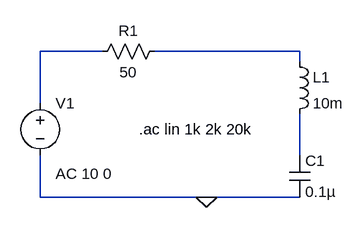
[diagram p0: schematic Draft3.asc]
Draft3.asc, the LTspice schematic file:
Version 4
SHEET 1 880 680
WIRE 112 48 16 48
WIRE 416 48 192 48
WIRE 416 64 416 48
WIRE 16 128 16 48
WIRE 416 208 416 144
WIRE 16 272 16 208
WIRE 272 272 16 272
WIRE 416 272 272 272
FLAG 272 272 0
SYMBOL voltage 16 112 R0
WINDOW 123 24 124 Left 2
WINDOW 39 0 0 Left 0
SYMATTR InstName V1
SYMATTR Value ""
SYMATTR Value2 AC 10 0
SYMBOL res 208 32 R90
WINDOW 0 0 56 VBottom 2
WINDOW 3 32 56 VTop 2
SYMATTR InstName R1
SYMATTR Value 50
SYMBOL ind 400 48 R0
SYMATTR InstName L1
SYMATTR Value 10m
SYMATTR SpiceLine Rser=28
SYMBOL cap 400 208 R0
SYMATTR InstName C1
SYMATTR Value 0.1µ
TEXT 168 168 Left 2 !.ac lin 1k 2k 20k

The netlist it stands for:
* Draft3.asc
V1 N001 0 AC 10 0
R1 N002 N001 50
L1 N002 N003 10m Rser=28
C1 N003 0 0.1µ
.ac lin 1k 2k 20k
.backanno
.end